# EAGLE design esp32_r1 (EAGLE 9.3.0)
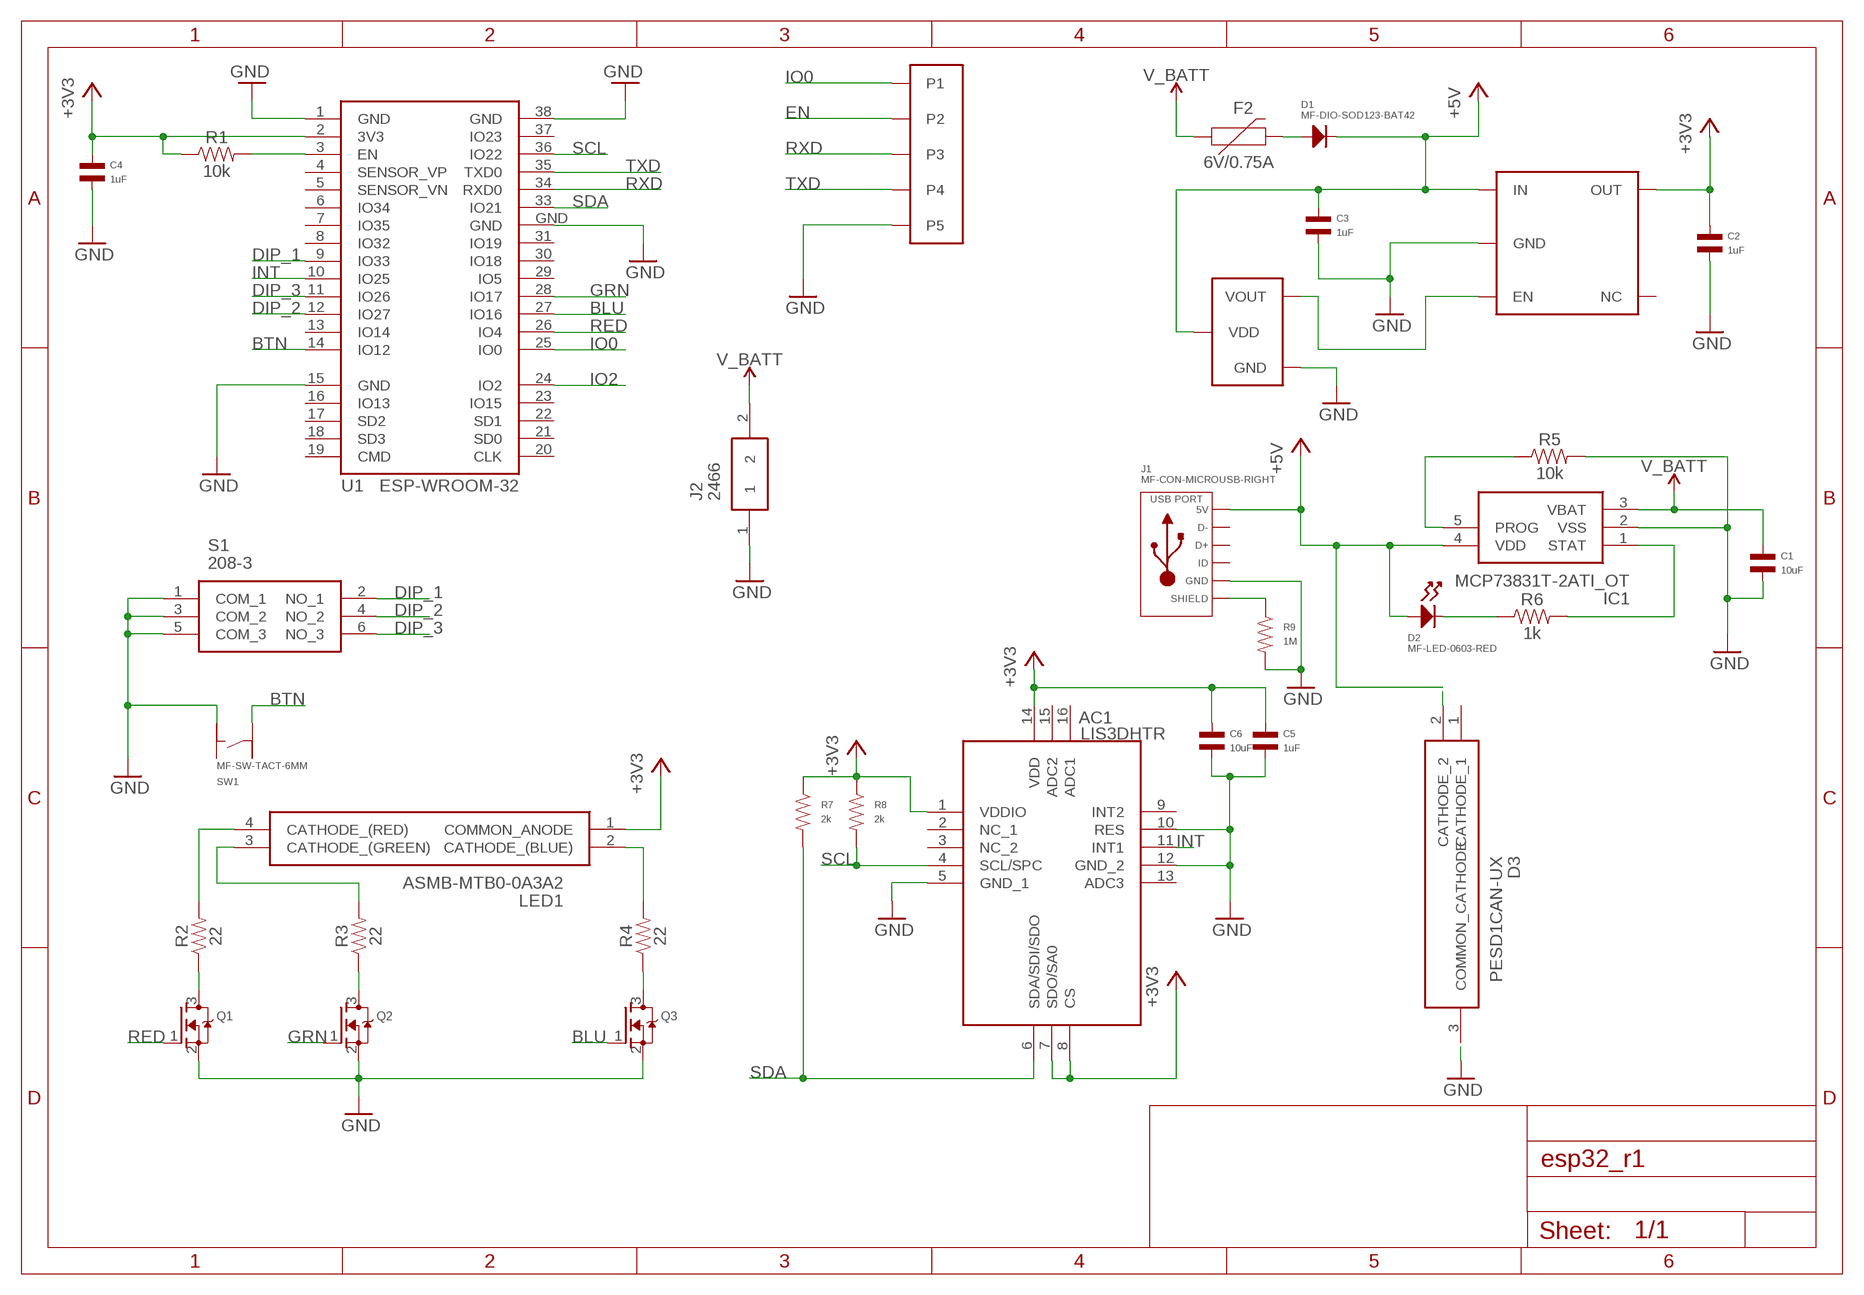
[diagram p0: schematic, sheet 1]

## Parts
AC1  LIS3DHTR  [PQFN50P300X300X100-16N]
C1  10uF  CAPACITOR_NP_1206  [C1206]
C2  1uF  CAPACITOR_NP_0402  [C0402]
C3  1uF  CAPACITOR_NP_0402  [C0402]
C4  1uF  CAPACITOR_NP_0402  [C0402]
C5  1uF  CAPACITOR_NP_0402  [C0402]
C6  10uF  CAPACITOR_NP_1206  [C1206]
D1  MF-DIO-SOD123-BAT42  DIODES_BAT42_SOD-123  [SOD-123]
D2  MF-LED-0603-RED  LED_SINGLE-0603-RED  [LED0603]
D3  PESD1CAN-UX  [SOT95P230X110-3N]
F2  6V/0.75A  PPTC_THREE-QUARTER-AMP  [1206]
IC1  MCP73831T-2ATI_OT  [SOT95P270X145-5N]
J1  MF-CON-MICROUSB-RIGHT  USB_MICRO_RIGHT  [MICROUSB-RIGHT]
J2  2466  [2466]
LED1  ASMB-MTB0-0A3A2  [AVAGO_PLCC4]
Q1  MOSFET-NREFLOW  [SOT23-R]
Q2  MOSFET-NREFLOW  [SOT23-R]
Q3  MOSFET-NREFLOW  [SOT23-R]
R1  10k  100KOHM-0402-1/16W-1%  [0402]
R2  22  22OHM-0402-1/10W-1%  [0402]
R3  22  22OHM-0402-1/10W-1%  [0402]
R4  22  22OHM-0402-1/10W-1%  [0402]
R5  10k  100KOHM-0402-1/16W-1%  [0402]
R6  1k  100KOHM-0402-1/16W-1%  [0402]
R7  2k  RESISTOR_0402  [R0402]
R8  2k  RESISTOR_0402  [R0402]
R9  1M  RESISTOR_0402  [R0402]
S1  208-3  [2083]
SW1  MF-SW-TACT-6MM  TACT_6MM  [TACT6MM]
U1  ESP-WROOM-32  [ESP-WROOM-32]
U4  TLV755  [SOT23-DBV]
U6  53047  [PICOBLADE_53047]
U7  BD49K33G  [SSOP3]

## Nets
+3V3: AC1.1(VDDIO) AC1.7(SDO/SA0) AC1.8(CS) AC1.14(VDD) C2.P$1 C4.P$1 C5.P$1 C6.P$1 LED1.1(COMMON_ANODE) R1.1 R7.P$1 R8.P$1 U1.2(3V3) U4.5(OUT)
+5V: C3.P$1 D1.CATHODE D2.ANODE D3.2(CATHODE_2) IC1.4(VDD) J1.1(5V) U4.1(IN) U7.P$3(VDD)
BLU: Q3.1(G) U1.27(IO16)
BTN: SW1.P$4 U1.14(IO12)
DIP_1: S1.2(NO_1) U1.9(IO33)
DIP_2: S1.4(NO_2) U1.12(IO27)
DIP_3: S1.6(NO_3) U1.11(IO26)
EN: R1.2 U1.3(EN) U6.P$2(P2)
GND: AC1.5(GND_1) AC1.10(RES) AC1.12(GND_2) C1.P$2 C2.P$2 C3.P$2 C4.P$2 C5.P$2 C6.P$2 D3.3(COMMON_CATHODE) IC1.2(VSS) J1.5(GND) J2.1 Q1.2(S) Q2.2(S) Q3.2(S) R5.2 R9.P$2 S1.1(COM_1) S1.3(COM_2) S1.5(COM_3) SW1.P$2 U1.1(GND) U1.15(GND) U1.38(GND) U1.GND U4.2(GND) U6.P$5(P5) U7.P$1(GND)
GRN: Q2.1(G) U1.28(IO17)
INT: AC1.11(INT1) U1.10(IO25)
IO0: U1.25(IO0) U6.P$1(P1)
IO2: U1.24(IO2)
N$1: U4.3(EN) U7.P$2(VOUT)
N$2: LED1.4(CATHODE_(RED)) R2.2
N$3: Q1.3(D) R2.1
N$4: LED1.3(CATHODE_(GREEN)) R3.2
N$5: Q2.3(D) R3.1
N$6: LED1.2(CATHODE_(BLUE)) R4.2
N$7: Q3.3(D) R4.1
N$8: D1.ANODE F2.2
N$9: J1.S1(SLD) J1.S2(SLD) J1.S3(SLD) J1.S4(SLD) J1.S5(SLD) J1.S6(SLD) R9.P$1
N$10: IC1.5(PROG) R5.1
N$11: D2.CATHODE R6.1
N$12: IC1.1(STAT) R6.2
RED: Q1.1(G) U1.26(IO4)
RXD: U1.34(RXD0) U6.P$3(P3)
SCL: AC1.4(SCL/SPC) R8.P$2 U1.36(IO22)
SDA: AC1.6(SDA/SDI/SDO) R7.P$2 U1.33(IO21)
TXD: U1.35(TXD0) U6.P$4(P4)
V_BATT: C1.P$1 F2.1 IC1.3(VBAT) J2.2
Unconnected: AC1.2(NC_1) AC1.3(NC_2) AC1.9(INT2) AC1.13(ADC3) AC1.15(ADC2) AC1.16(ADC1) D3.1(CATHODE_1) J1.2(D-) J1.3(D+) J1.4(ID) SW1.P$1 SW1.P$3 U1.4(SENSOR_VP) U1.5(SENSOR_VN) U1.6(IO34) U1.7(IO35) U1.8(IO32) U1.13(IO14) U1.16(IO13) U1.17(SD2) U1.18(SD3) U1.19(CMD) U1.20(CLK) U1.21(SD0) U1.22(SD1) U1.23(IO15) U1.29(IO5) U1.30(IO18) U1.31(IO19) U1.37(IO23) U4.4(NC)

## Library data of the parts
AC1 = samacsys:LIS3DHTR: Accelerometer 3-Axis 2g/16g 1.8V LGA16 STMicroelectronics LIS3DHTR Accelerometer IC, 3-axis, I2C, SPI 1.71 3.6 V, 16-Pin LGA Source: Datasheet <http://www.st.com/web/en/resource/technical/document/datasheet/CD00274221.pdf>; ALLIED_NUMBER: 70521157; ALLIED_PRICE-STOCK: http://www.alliedelec.com/stmicroelectronics-lis3dhtr/70521157/; DESCRIPTION: Accelerometer 3-Axis 2g/16g 1.8V LGA16 STMicroelectronics LIS3DHTR Accelerometer IC, 3-axis, I2C, SPI 1.71 3.6 V, 16-Pin LGA; HEIGHT: 1mm; MANUFACTURER_NAME: STMicroelectronics; MANUFACTURER_PART_NUMBER: LIS3DHTR; MOUSER_PART_NUMBER: 511-LIS3DHTR; MOUSER_PRICE-STOCK: https://www.mouser.com/Search/Refine.aspx?Keyword=511-LIS3DHTR; RS_PART_NUMBER: 7931364P; RS_PRICE-STOCK: http://uk.rs-online.com/web/p/products/7931364P
C1-C6 = MF_Passives:CAPACITOR_NP: Library: MF_Passives Description: Device for Non-Polarized Capacitors. Manufacture part number (MPN) can be added via Attributes. Check https://factory.macrofab.com/parts for the house parts list.; POPULATE: 1
D1 = MF_Discrete_Semiconductor:DIODES: Library: MF_Discrete_Semiconductor Description: Device for Single Packaged Diodes.; HOUSEPART: YES; MPN: MF-DIO-SOD123-BAT42; POPULATE: 1; URL: https://factory.macrofab.com/part/MF-DIO-SOD123-BAT42
D2 = MF_LEDs:LED_SINGLE: Library: MF_LEDs Description: Device for Single LED Packages. Manufacture part number (MFG#) can be added via Attributes.; HOUSEPART: YES; MPN: MF-LED-0603-RED; POPULATE: 1; URL: https://factory.macrofab.com/part/MF-LED-0603-RED
D3 = samacsys:PESD1CAN-UX: NXP PESD1CAN, Dual Bi-Directional TVS Diode, 3-Pin SOT-23 Source: Datasheet <https://assets.nexperia.com/documents/data-sheet/PESD1CAN.pdf>; DESCRIPTION: NXP PESD1CAN, Dual Bi-Directional TVS Diode, 3-Pin SOT-23; HEIGHT: 1.1mm; MANUFACTURER_NAME: Nexperia; MANUFACTURER_PART_NUMBER: PESD1CAN-UX; MOUSER_PART_NUMBER: 771-PESD1CANUX; MOUSER_PRICE-STOCK: https://www.mouser.com/Search/Refine.aspx?Keyword=771-PESD1CANUX; RS_PART_NUMBER: 1362213P; RS_PRICE-STOCK: http://uk.rs-online.com/web/p/products/1362213P
F2 = SparkFun-Fuses:PPTC: Resettable Fuse PPTC Resettable Fuse. Really a sort of resistor with a polymeric positive temperature coefficient whose resistance increases dramatically with an increase in temperature. When heated by the power passing through the resistance rises causing the current to be limited, protecting the circuit. This is achieved by the transition of the polymer from a crystalline to an amorphous state where the conductive carbon separates breaking the conductive pathways found in the cool crystalline structure. When a PPTC cools back down it resumes conducting letting the circuit turn back on. SparkFun Products: SparkFun RedBoard - Programmed with Arduino <https://www.sparkfun.com/products/12757> Pro Micro - 5V/16MHz <https://www.sparkfun.com/products/12640> Arduino Pro 328 - 5V/16MHz <https://www.sparkfun.com/products/10915> MP3 Trigger <https://www.sparkfun.com/products/13720>; PROD_ID: RES-11150
IC1 = samacsys:MCP73831T-2ATI_OT: Microchip MCP73831T-2ATI/OT, Battery Charge Controller Lithium-Ion/Polymer, 500mA, 5-pin SOT-23 Source: Datasheet <http://docs-emea.rs-online.com/webdocs/1381/0900766b81381747.pdf>; ALLIED_NUMBER: 70388655; ALLIED_PRICE-STOCK: http://www.alliedelec.com/microchip-technology-inc-mcp73831t-2ati-ot/70388655/; DESCRIPTION: Microchip MCP73831T-2ATI/OT, Battery Charge Controller Lithium-Ion/Polymer, 500mA, 5-pin SOT-23; HEIGHT: 1.45mm; MANUFACTURER_NAME: Microchip; MANUFACTURER_PART_NUMBER: MCP73831T-2ATI/OT; MOUSER_PART_NUMBER: 579-MCP73831T-2ATIOT; MOUSER_PRICE-STOCK: https://www.mouser.com/Search/Refine.aspx?Keyword=579-MCP73831T-2ATIOT; RS_PART_NUMBER: 7386617P; RS_PRICE-STOCK: http://uk.rs-online.com/web/p/products/7386617P
J1 = MF_Connectors:USB: Library: MF_Connectors Description: 5 Pin USB Connectors. SLD is the shield connection. Usually tied to ground through a small ferrite bead.; HOUSEPART: YES; MPN: MF-CON-MICROUSB-RIGHT; POPULATE: 1; URL: https://factory.macrofab.com/part/MF-CON-MICROUSB-RIGHT
J2 = samacsys:2466: Cylindrical Battery Contacts, Clips, Holders & Springs AAA P.C.B HOLDER Source: Datasheet <http://keyelco.com/userAssets/file/M65p28.pdf>; ALLIED_NUMBER: 70182863; ALLIED_PRICE-STOCK: https://www.alliedelec.com/keystone-electronics-2466/70182863/; DESCRIPTION: Cylindrical Battery Contacts, Clips, Holders & Springs AAA P.C.B HOLDER; HEIGHT: 13.72mm; MANUFACTURER_NAME: Keystone Electronics; MANUFACTURER_PART_NUMBER: 2466; MOUSER_PART_NUMBER: 534-2466; MOUSER_PRICE-STOCK: https://www.mouser.com/Search/Refine.aspx?Keyword=534-2466
LED1 = samacsys:ASMB-MTB0-0A3A2: Standard LEDs - SMD PLCC4T MtBS WF Silicone RGB Source: Datasheet <http://docs-emea.rs-online.com/webdocs/133c/0900766b8133c17d.pdf>; DESCRIPTION: Standard LEDs - SMD PLCC4T MtBS WF Silicone RGB; HEIGHT: mm; MANUFACTURER_NAME: Avago Technologies; MANUFACTURER_PART_NUMBER: ASMB-MTB0-0A3A2; MOUSER_PART_NUMBER: 630-ASMB-MTB0-0A3A2; MOUSER_PRICE-STOCK: https://www.mouser.com/Search/Refine.aspx?Keyword=630-ASMB-MTB0-0A3A2; RS_PART_NUMBER: 8305044P; RS_PRICE-STOCK: http://uk.rs-online.com/web/p/products/8305044P
Q1-Q3 = microbuilder:MOSFET-N: N-Channel Mosfet LEGEND VDS: Voltage Drain-Source ID: Drain Current RDS(ON): Drain-Source On-State Resistance VGS(TH): Gate-Source Threshold Voltage CISS: Drain-Source Input Capacitance SOT-23 Name VDS ID RDS(ON) VGS(TH) CISS Order Number 2N7002E 60V 260mA 2.5 Ohm 2.5V @ 250uA 26.7pF @ 25V 2N7002ET1GOSTR-ND BSH103 30V 850mA 400 mOhm 400mV @ 1mA 83pF @ 24V BSH103,235-ND BSS138 60V 320mA 1.6 Ohm 1.5V @ 250uA 50pF @ 10V Mouser: 771-BSS138PW115 DMN2075U-7 20V 4.2A 38 mOhm 1V @ 250 uA 594.3pF @ 10V DMN2075U-7DICT-ND * BSS138 good choice for I2C level-shifting
R1 R5 R6 = SparkFun-Resistors:100KOHM: 100kΩ resistor A resistor is a passive two-terminal electrical component that implements electrical resistance as a circuit element. Resistors act to reduce current flow, and, at the same time, act to lower voltage levels within circuits. - Wikipedia; PROD_ID: RES-13495; VALUE: 100K
R2-R4 = SparkFun-Resistors:22OHM: 22Ω resistor A resistor is a passive two-terminal electrical component that implements electrical resistance as a circuit element. Resistors act to reduce current flow, and, at the same time, act to lower voltage levels within circuits. - Wikipedia; PROD_ID: RES-12427
R7-R9 = MF_Passives:RESISTOR: Library: MF_Passives Description: Device for Resistors. Manufacture part number (MPN), Voltage, Tolerance, and Wattage Rating can be added via Attributes. Check https://factory.macrofab.com/parts for the house parts list.; POPULATE: 1
S1 = samacsys:208-3: 3 Way Through Hole DIP Switch Single Pole Single Throw (SPST), Standard Actuator Source: Datasheet <https://www.ctscorp.com/wp-content/uploads/208.pdf>; DESCRIPTION: 3 Way Through Hole DIP Switch Single Pole Single Throw (SPST), Standard Actuator; HEIGHT: 8.49mm; MANUFACTURER_NAME: CTS; MANUFACTURER_PART_NUMBER: 208-3; MOUSER_PART_NUMBER: 774-2083; MOUSER_PRICE-STOCK: https://www.mouser.com/Search/Refine.aspx?Keyword=774-2083; RS_PART_NUMBER: 1774319; RS_PRICE-STOCK: http://uk.rs-online.com/web/p/products/1774319
SW1 = MF_Switches:TACT: Library: MF_Switches Description: Device for Tact Switches. Manufacture part number (MFG#) can be added via Attributes.; HOUSEPART: YES; MPN: MF-SW-TACT-6MM; POPULATE: 1; URL: https://factory.macrofab.com/part/MF-SW-TACT-6MM
U1 = esp32:ESP-WROOM-32: Espressif Systems ESP-WROOM-32
U4 = texas:TLV755
U6 = molex:53047
U7 = rohm:BD49K33G: Supervisor

## Board
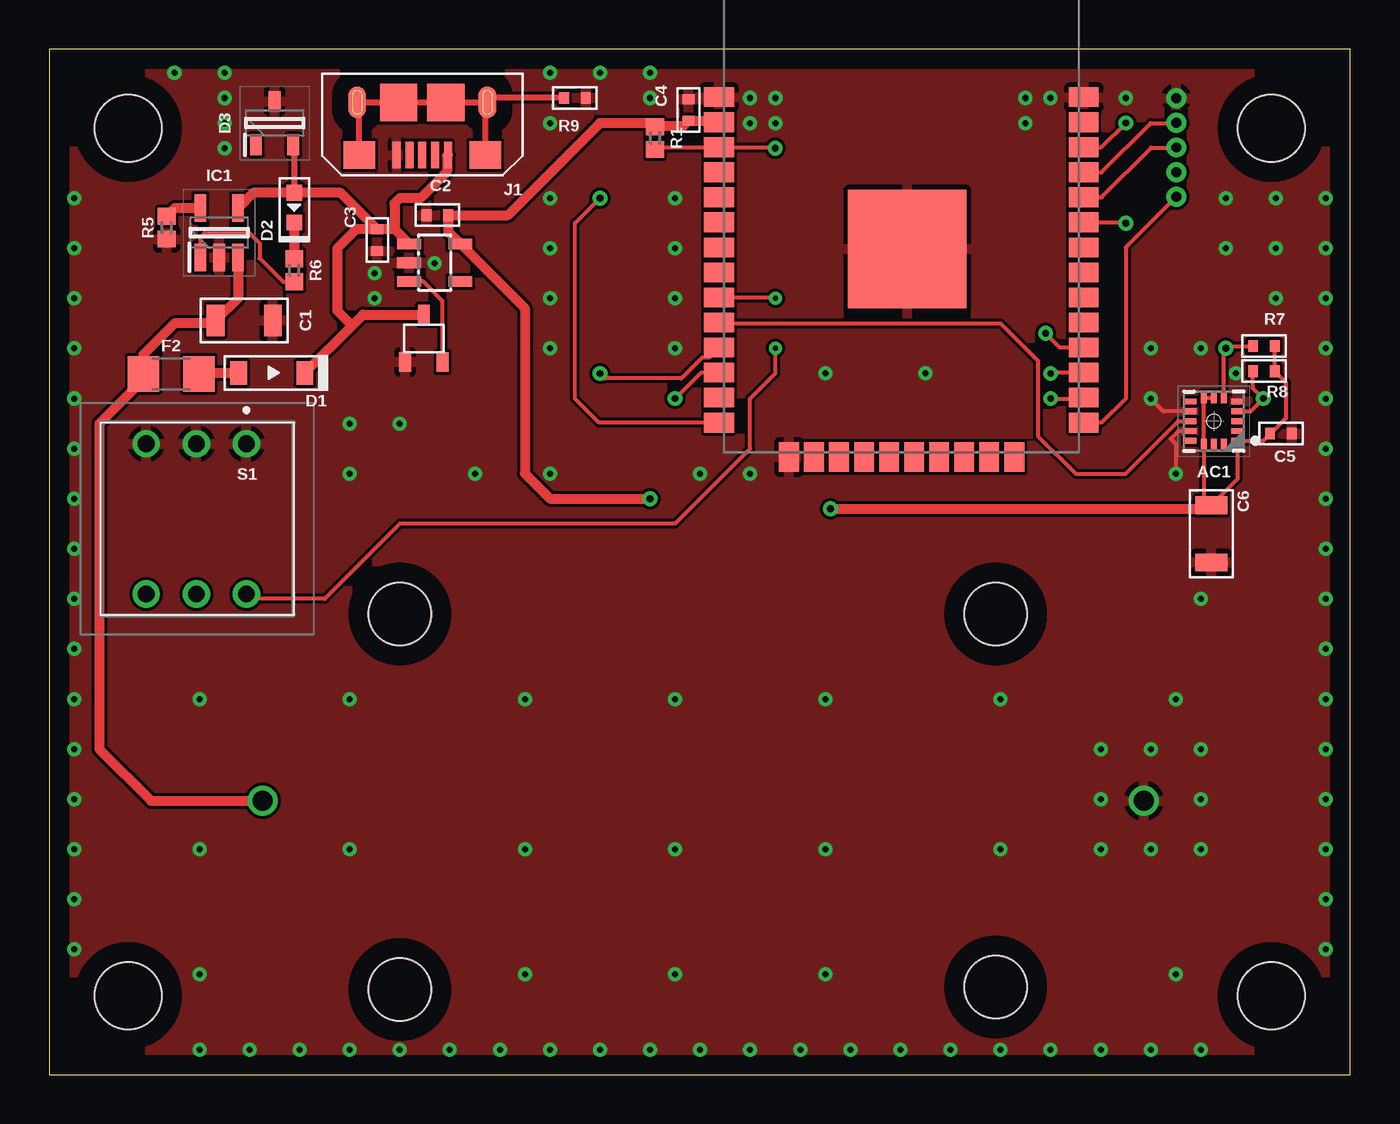
[diagram p1: board, top side]
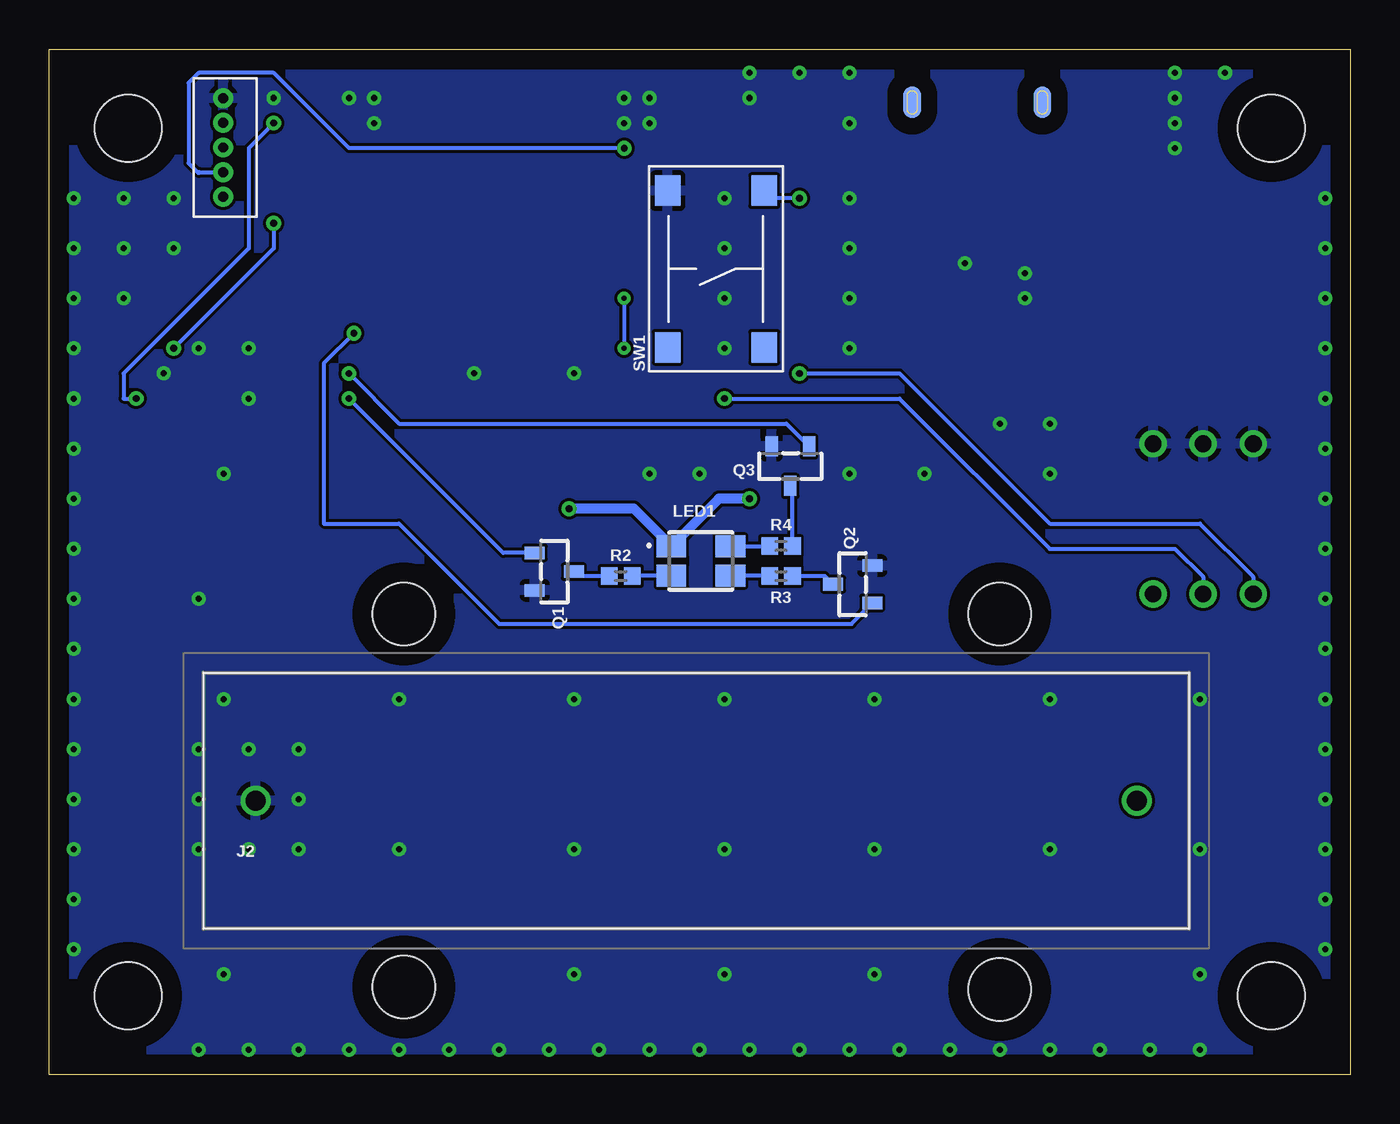
[diagram p2: board, bottom side, seen from below]

Size 66 x 52 mm. Coordinates in mm from the lower left corner, seen from the top.
Outline: 0,0 66,0 66,52 0,52 0,0
Copper layers (1*16): Top 0.035mm / dielectric 1.5mm / Bottom 0.035mm
Design rules "default": minimum track width 6mil, minimum drill 0.35mm, track to track 6mil, track to pad 6mil, pad to pad 6mil, via to via 6mil, smd to smd 6mil, copper to edge 40mil, drill to drill 6mil, minimum pad ring 10mil, minimum via ring 8mil, stop-mask expansion 4mil, vias tented up to drill 25mil, thermal gap 10mil
Holes 3.17 mm at 17.78,23.37 48.01,23.37 17.78,4.32 48.01,4.45
Holes 3.4 mm at 4,4 62,4 62,48 4,48

### Footprints (pad centres in the part's own frame; a part is rotated, then mirrored left to right if it is on the bottom)
PQFN50P300X300X100-16N = smd 0.6 x 0.3: 1 -1.2,1; 2 -1.2,0.5; 3 -1.2,0; 4 -1.2,-0.5; 5 -1.2,-1; 9 1.2,-1; 10 1.2,-0.5; 11 1.2,0; 12 1.2,0.5; 13 1.2,1 | smd 0.3 x 0.6: 6 -0.5,-1.2; 7 0,-1.2; 8 0.5,-1.2; 14 0.5,1.2; 15 0,1.2; 16 -0.5,1.2
C1206 = smd 0.9 x 1.6: P$1 -1.45,0; P$2 1.45,0
C0402 = smd 0.5 x 0.6: P$1 -0.55,0; P$2 0.55,0
SOD-123 = smd 0.85 x 1.2: ANODE 1.675,0; CATHODE -1.675,0
LED0603 = smd 0.8 x 0.8: ANODE 0.75,0; CATHODE -0.75,0
SOT95P230X110-3N = smd 1.05 x 0.6: 1 -1.1,0.95; 2 -1.1,-0.95; 3 1.1,0
1206 = smd 1.6 x 1.8: 1 -1.4,0; 2 1.4,0
SOT95P270X145-5N = smd 1.4 x 0.6: 1 -1.25,0.95; 2 -1.25,0; 3 -1.25,-0.95; 4 1.25,-0.95; 5 1.25,0.95
MICROUSB-RIGHT = smd 0.4 x 1.35: 1 -1.3,1.27; 2 -0.65,1.27; 3 0,1.27; 4 0.65,1.27; 5 1.3,1.27 | smd 0.9 x 1.6: S1 -3.3,-1.4; S2 3.3,-1.4 | smd 1.6 x 1.4: S3 -3.2,1.27; S4 3.2,1.27 | smd 1.9 x 1.9: S5 -1.2,-1.405; S6 1.2,-1.405 | smd 0.9 x 1.6 bottom: S7 -3.3,-1.4; S8 3.3,-1.4
2466 = drill 1.02 pad 1.53: 1 0,0; 2 44.7,0
AVAGO_PLCC4 = smd 1.1 x 1.5: 1 -0.75,-1.5; 2 -0.75,1.5; 3 0.75,1.5; 4 0.75,-1.5
SOT23-R = smd 0.635 x 1.016: 1 -0.95,-1; 2 0.95,-1; 3 0,1
0402 = smd 0.85 x 0.9: 1 -0.58,0; 2 0.58,0
R0402 = smd 0.5 x 0.6: P$1 -0.55,0; P$2 0.55,0
2083 = drill 0.85 pad 1.381: 1 0,0; 2 0,7.62; 3 2.54,0; 4 2.54,7.62; 5 5.08,0; 6 5.08,7.62
TACT6MM = smd 1.55 x 1.3: P$1 -3.975,2.45; P$2 3.975,2.45; P$3 -3.975,-2.45; P$4 3.975,-2.45
ESP-WROOM-32 = smd 1.5 x 1: 1 -9.25,7; 2 -9.25,5.73; 3 -9.25,4.46; 4 -9.25,3.19; 5 -9.25,1.92; 6 -9.25,0.65; 7 -9.25,-0.62; 8 -9.25,-1.89; 9 -9.25,-3.16; 10 -9.25,-4.43; 11 -9.25,-5.7; 12 -9.25,-6.97; 13 -9.25,-8.24; 14 -9.25,-9.51; 25 9.25,-9.51; 26 9.25,-8.24; 27 9.25,-6.97; 28 9.25,-5.7; 29 9.25,-4.43; 30 9.25,-3.16; 31 9.25,-1.89; 32 9.25,-0.62; 33 9.25,0.65; 34 9.25,1.92; 35 9.25,3.19; 36 9.25,4.46; 37 9.25,5.73; 38 9.25,7 | smd 1 x 1.5: 15 -5.7,-11.25; 16 -4.43,-11.25; 17 -3.16,-11.25; 18 -1.89,-11.25; 19 -0.62,-11.25; 20 0.65,-11.25; 21 1.92,-11.25; 22 3.19,-11.25; 23 4.46,-11.25; 24 5.73,-11.25 | smd 6 x 6: GND 0.3,-0.7
SOT23-DBV = smd 0.55 x 1.2: 1 -0.95,-1.3; 2 0,-1.3; 3 0.95,-1.3; 4 0.95,1.3; 5 -0.95,1.3
PICOBLADE_53047 = drill 0.5 pad 0.813: P$1 -2.5,0; P$2 -1.25,0; P$3 0,0; P$4 1.25,0; P$5 2.5,0
SSOP3 = smd 0.6 x 1: P$1 -0.95,-1.2; P$2 0.95,-1.2; P$3 0,1.2

### Placement (x,y rotation side)
AC1  59.08,33.14 180 top
C1  9.89,38.26 0 top
C2  19.68,43.59 180 top
C3  16.64,42.32 270 top
C4  32.43,48.92 90 top
C5  62.48,32.51 0 top
C6  58.95,27.43 270 top
D1  11.29,35.59 180 top
D2  12.43,43.97 90 top
D3  11.43,48.26 90 top
F2  6.18,35.54 0 top
IC1  8.62,42.7 90 top
J1  18.92,47.91 180 top
J2  55.53,13.89 0 bottom
LED1  32.94,26.05 270 bottom
Q1  40.38,25.51 270 bottom
Q2  25.24,24.87 90 bottom
Q3  28.4,30.86 180 bottom
R1  30.73,47.5 270 top
R2  37,25.29 0 bottom
R3  28.88,25.29 180 bottom
R4  28.88,26.81 180 bottom
R5  5.95,42.95 270 top
R6  12.43,40.8 270 top
R7  61.62,36.95 180 top
R8  61.62,35.68 180 top
R9  26.67,49.53 0 top
S1  10,32 180 top
SW1  32.18,40.86 90 bottom
U1  43.23,42.57 0 top
U4  19.56,41.18 270 top
U6  57.17,47.02 90 bottom
U7  19,37.34 0 top

### Tracks (layer width: path | path; a pad name or v marks a point on that pad's centre or on a via)
+3V3  (via drill 0.35)
  Top 0.203: AC1.7 AC1.8 AC1.14 58.58,29.25 C6.P$1 60.28,30.2 AC1.1 61.59,32.14 61.93,32.48 | R7.P$1 R8.P$1 62.74,35.11 62.74,33.28 61.93,32.48 | 61.93,32.48 C5.P$1
  Top 0.508: U1.2 33.91,48.37 C4.P$1 32.18,48.12 30.78,48.12 R1.1 30.55,48.26 27.94,48.26 23.27,43.59 C2.P$1 20.23,42.75 U4.5 24.13,38.85 24.13,30.48 25.4,29.21 v30.48,29.21 | v39.62,28.7 58.78,28.7 C6.P$1
  Bottom 0.508: v39.62,28.7 36.34,28.7 LED1.1 32.03,29.21 v30.48,29.21
+5V
  Top 0.305: D3.2 12.43,47.11 D2.ANODE
  Top 0.508: U4.1 17.52,42.87 | 17.52,42.87 C3.P$1 | J1.1 20.18,46.59 20.18,45.8 18.84,44.45 17.78,44.45 17.52,44.19 17.52,42.87 | C3.P$1 14.79,44.72 D2.ANODE 10.34,44.72 IC1.4 | D1.CATHODE 15.36,37.98 | 15.36,37.98 15.92,38.54 U7.P$3 | C3.P$1 15.56,42.87 14.61,41.91 14.61,38.73 15.36,37.98
BLU  (via drill 0.35)
  Top 0.203: U1.27 50.84,35.6 v50.8,35.56
  Bottom 0.203: v50.8,35.56 48.26,33.02 28.61,33.02 Q3.1
BTN  (via drill 0.35)
  Top 0.203: U1.14 27.9,33.06 26.67,34.29 26.67,43.18 v27.94,44.45
  Bottom 0.203: v27.94,44.45 29.34,44.45 SW1.P$4
DIP_1  (via drill 0.25)
  Top 0.203: S1.2 10.25,24.13 13.97,24.13 17.78,27.94 31.75,27.94 35.56,31.75 35.56,34.29 36.83,35.56 v36.83,36.83 | U1.9 36.79,39.41 v36.83,39.37
  Bottom 0.203: v36.83,39.37 v36.83,36.83
DIP_2  (via drill 0.35)
  Top 0.203: U1.12 33.06,35.6 v31.75,34.29
  Bottom 0.203: v31.75,34.29 22.86,34.29 15.24,26.67 8.89,26.67 7.46,25.24 S1.4
DIP_3  (via drill 0.35)
  Top 0.203: U1.11 33.46,36.36 33.12,36.36 32.07,35.31 28.19,35.31 v27.94,35.56
  Bottom 0.203: v27.94,35.56 22.86,35.56 15.24,27.94 7.62,27.94 4.92,25.24 S1.6
EN  (via drill 0.35)
  Top 0.203: v36.83,46.99 36.79,47.03 U1.3 30.85,47.03 R1.2
  Bottom 0.203: v36.83,46.99 50.8,46.99 54.61,50.8 58.42,50.8 58.93,50.29 58.93,46.23 58.42,45.72 58.37,45.77 U6.P$2
GND  (via drill 0.3)
  Top 0.203: AC1.10 56.53,33.64 v55.88,34.29 | AC1.12 57.28,32.64 56.9,32.26 57.15,32 v57.15,30.48
  other vias: 6.35,50.8 8.89,50.8 25.4,50.8 27.94,50.8 30.48,50.8 1.27,44.45 1.27,41.91 1.27,39.37 1.27,36.83 64.77,44.45 64.77,41.91 64.77,39.37 64.77,36.83 64.77,34.29 64.77,31.75 60.2,35.56 64.77,29.21 64.77,26.67 64.77,24.13 64.77,21.59 64.77,19.05 64.77,16.51 64.77,13.97 64.77,11.43 64.77,8.89 64.77,6.35 58.42,1.27 55.88,1.27 53.34,1.27 50.8,1.27 48.26,1.27 45.72,1.27 43.18,1.27 40.64,1.27 38.1,1.27 35.56,1.27 33.02,1.27 30.48,1.27 27.94,1.27 25.4,1.27 22.86,1.27 20.32,1.27 17.78,1.27 15.24,1.27 12.7,1.27 10.16,1.27 7.62,1.27 1.27,6.35 1.27,8.89 1.27,11.43 1.27,13.97 1.27,16.51 1.27,19.05 1.27,21.59 1.27,24.13 1.27,26.67 1.27,29.21 1.27,31.75 1.27,34.29 8.89,46.99 25.4,48.26 30.48,49.53 8.89,49.53 8.89,48.26 16.51,40.64 16.51,39.37 19.56,41.15 25.4,44.45 25.4,41.91 25.4,39.37 25.4,36.83 31.75,36.83 31.75,39.37 31.75,41.91 31.75,44.45 15.24,33.02 17.78,33.02 15.24,30.48 21.59,30.48 25.4,30.48 33.02,30.48 62.23,44.45 59.69,44.45 59.69,41.91 62.23,41.91 62.23,39.37 55.88,16.51 53.34,16.51 53.34,13.97 53.34,11.43 55.88,11.43 58.42,11.43 58.42,13.97 58.42,16.51 58.42,24.13 57.15,19.05 48.26,19.05 39.37,19.05 31.75,19.05 24.13,19.05 15.24,19.05 7.62,19.05 15.24,11.43 7.62,11.43 24.13,11.43 31.75,11.43 39.37,11.43 48.26,11.43 7.62,5.08 24.13,5.08 31.75,5.08 39.37,5.08 57.15,5.08 35.56,48.26 35.56,49.53 36.83,49.53 36.83,48.26 50.8,49.53 49.53,49.53 49.53,48.26 39.37,35.56 44.45,35.56 35.56,30.48 54.61,49.53 58.42,36.83 55.88,36.83
  pour Bottom: 0,0 68.58,0 68.58,53.34 0,53.34
  pour Top: 0,0 69.85,0 69.85,54.61 0,54.61
GRN  (via drill 0.35)
  Top 0.203: U1.28 51.26,36.87 v50.55,37.59
  Bottom 0.203: v50.55,37.59 52.07,36.07 52.07,27.94 48.26,27.94 43.18,22.86 25.3,22.86 Q2.1
INT
  Top 0.203: U1.10 34.02,38.1 48.26,38.1 50.16,36.2 50.16,32.38 52.07,30.48 54.61,30.48 57.27,33.14 AC1.11
IO0
  Top 0.203: U6.P$1 54.61,41.96 54.61,34.29 53.38,33.06 U1.25
N$1
  Top 0.203: U7.P$2 19.95,39.23 18.95,40.23 U4.3
N$2
  Bottom 0.203: LED1.4 R2.2
N$3
  Bottom 0.203: R2.1 39.16,25.29 Q1.3
N$4
  Bottom 0.203: R3.2 LED1.3
N$5
  Bottom 0.203: Q2.3 26.66,25.29 R3.1
N$6
  Bottom 0.203: LED1.2 R4.2
N$7
  Bottom 0.203: R4.1 28.3,29.76 Q3.3
N$8
  Top 0.508: F2.2 7.63,35.59 D1.ANODE
N$9
  Top 0.305: R9.P$1 22.45,49.53 J1.S1 22.12,49.21 | J1.S4 15.72,49.21 J1.S2 J1.S6 J1.S5 22.02,49.31 22.12,49.21 | J1.S3 22.12,49.21
N$10
  Top 0.508: IC1.5 6.37,43.95 R5.1
N$11
  Top 0.508: D2.CATHODE R6.1
N$12
  Top 0.203: IC1.1 7.67,42.47 7.87,42.67 10.16,42.67 10.67,42.16 10.67,41.4 11.86,40.22 R6.2
RED  (via drill 0.35)
  Top 0.203: v50.8,34.29 52.43,34.29 U1.26
  Bottom 0.203: Q1.1 42.97,26.46 v50.8,34.29
RXD
  Top 0.203: U1.34 53.38,44.49 55.91,47.02 U6.P$3
SCL  (via drill 0.35)
  Top 0.203: U1.36 53.38,47.03 v54.61,48.26 | R8.P$2 61.07,34.81 v61.59,34.29 60.95,33.64 AC1.4
  Bottom 0.203: v54.61,48.26 55.88,46.99 55.88,41.91 62.23,35.56 62.23,34.29 v61.59,34.29
SDA  (via drill 0.35)
  Top 0.203: AC1.6 59.58,36.72 v59.69,36.83 59.81,36.95 R7.P$2 | U1.33 54.57,43.22 v54.61,43.18
  Bottom 0.203: v54.61,43.18 54.61,41.91 v59.69,36.83
TXD
  Top 0.203: U1.35 53.38,45.76 55.88,48.26 U6.P$4
V_BATT
  Top 0.508: IC1.3 9.57,39.38 C1.P$1 8.29,38.1 6.35,38.1 4.78,36.53 F2.1 4.78,35.26 2.54,33.02 2.54,16.51 5.16,13.89 J2.2